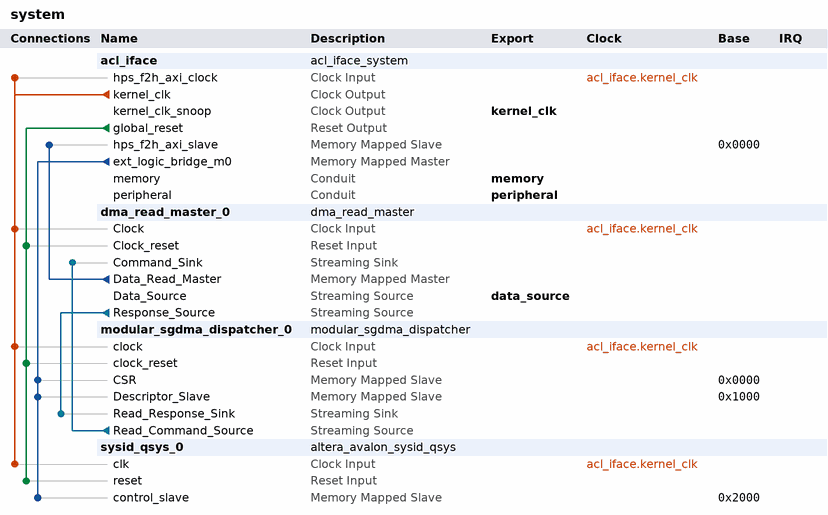
[diagram p0: system contents]
# Platform Designer (Qsys) system system, Cyclone V 5CSXFC6C6U23C7
# Parameters at their usual value, and those the tool derives, are not listed.
package require -exact qsys 16.0
create_system system
set_project_property DEVICE_FAMILY {Cyclone V}
set_project_property DEVICE 5CSXFC6C6U23C7

add_instance acl_iface acl_iface_system 1.0

add_instance dma_read_master_0 dma_read_master 16.0
set_instance_parameter_value dma_read_master_0 BURST_ENABLE 1
set_instance_parameter_value dma_read_master_0 CHANNEL_ENABLE 0
set_instance_parameter_value dma_read_master_0 CHANNEL_WIDTH 8
set_instance_parameter_value dma_read_master_0 DATA_WIDTH 64
set_instance_parameter_value dma_read_master_0 ERROR_ENABLE 0
set_instance_parameter_value dma_read_master_0 ERROR_WIDTH 8
set_instance_parameter_value dma_read_master_0 FIFO_DEPTH 1024
set_instance_parameter_value dma_read_master_0 FIFO_SPEED_OPTIMIZATION 1
set_instance_parameter_value dma_read_master_0 FIX_ADDRESS_WIDTH 32
set_instance_parameter_value dma_read_master_0 GUI_BURST_WRAPPING_SUPPORT 0
set_instance_parameter_value dma_read_master_0 GUI_MAX_BURST_COUNT 128
set_instance_parameter_value dma_read_master_0 GUI_PROGRAMMABLE_BURST_ENABLE 0
set_instance_parameter_value dma_read_master_0 GUI_STRIDE_WIDTH 1
set_instance_parameter_value dma_read_master_0 LENGTH_WIDTH 32
set_instance_parameter_value dma_read_master_0 PACKET_ENABLE 0
set_instance_parameter_value dma_read_master_0 STRIDE_ENABLE 0
set_instance_parameter_value dma_read_master_0 TRANSFER_TYPE {Aligned Accesses}
set_instance_parameter_value dma_read_master_0 USE_FIX_ADDRESS_WIDTH 0

add_instance modular_sgdma_dispatcher_0 modular_sgdma_dispatcher 16.0
set_instance_parameter_value modular_sgdma_dispatcher_0 BURST_ENABLE 0
set_instance_parameter_value modular_sgdma_dispatcher_0 BURST_WRAPPING_SUPPORT 0
set_instance_parameter_value modular_sgdma_dispatcher_0 CSR_ADDRESS_WIDTH 3
set_instance_parameter_value modular_sgdma_dispatcher_0 DATA_FIFO_DEPTH 32
set_instance_parameter_value modular_sgdma_dispatcher_0 DATA_WIDTH 32
set_instance_parameter_value modular_sgdma_dispatcher_0 DESCRIPTOR_FIFO_DEPTH 16
set_instance_parameter_value modular_sgdma_dispatcher_0 ENHANCED_FEATURES 1
set_instance_parameter_value modular_sgdma_dispatcher_0 GUI_RESPONSE_PORT 0
set_instance_parameter_value modular_sgdma_dispatcher_0 MAX_BURST_COUNT 2
set_instance_parameter_value modular_sgdma_dispatcher_0 MAX_BYTE 1024
set_instance_parameter_value modular_sgdma_dispatcher_0 MAX_STRIDE 1
set_instance_parameter_value modular_sgdma_dispatcher_0 MODE 1
set_instance_parameter_value modular_sgdma_dispatcher_0 PREFETCHER_USE_CASE 0
set_instance_parameter_value modular_sgdma_dispatcher_0 PROGRAMMABLE_BURST_ENABLE 0
set_instance_parameter_value modular_sgdma_dispatcher_0 STRIDE_ENABLE 0
set_instance_parameter_value modular_sgdma_dispatcher_0 TRANSFER_TYPE {Aligned Accesses}

add_instance sysid_qsys_0 altera_avalon_sysid_qsys 16.0
set_instance_parameter_value sysid_qsys_0 id -1091581186

# connections
add_connection acl_iface.kernel_clk acl_iface.hps_f2h_axi_clock clock
add_connection acl_iface.kernel_clk dma_read_master_0.Clock clock
add_connection acl_iface.kernel_clk modular_sgdma_dispatcher_0.clock clock
add_connection acl_iface.kernel_clk sysid_qsys_0.clk clock
add_connection acl_iface.global_reset dma_read_master_0.Clock_reset reset
add_connection acl_iface.global_reset modular_sgdma_dispatcher_0.clock_reset reset
add_connection acl_iface.global_reset sysid_qsys_0.reset reset
add_connection acl_iface.ext_logic_bridge_m0 modular_sgdma_dispatcher_0.CSR avalon
set_connection_parameter_value acl_iface.ext_logic_bridge_m0/modular_sgdma_dispatcher_0.CSR baseAddress 0x0000
add_connection acl_iface.ext_logic_bridge_m0 modular_sgdma_dispatcher_0.Descriptor_Slave avalon
set_connection_parameter_value acl_iface.ext_logic_bridge_m0/modular_sgdma_dispatcher_0.Descriptor_Slave baseAddress 0x1000
add_connection acl_iface.ext_logic_bridge_m0 sysid_qsys_0.control_slave avalon
set_connection_parameter_value acl_iface.ext_logic_bridge_m0/sysid_qsys_0.control_slave baseAddress 0x2000
add_connection dma_read_master_0.Data_Read_Master acl_iface.hps_f2h_axi_slave avalon
set_connection_parameter_value dma_read_master_0.Data_Read_Master/acl_iface.hps_f2h_axi_slave baseAddress 0x0000
add_connection dma_read_master_0.Response_Source modular_sgdma_dispatcher_0.Read_Response_Sink avalon_streaming
add_connection modular_sgdma_dispatcher_0.Read_Command_Source dma_read_master_0.Command_Sink avalon_streaming

# exported interfaces
add_interface data_source avalon_streaming source
set_interface_property data_source EXPORT_OF dma_read_master_0.Data_Source
add_interface kernel_clk clock source
set_interface_property kernel_clk EXPORT_OF acl_iface.kernel_clk_snoop
add_interface memory conduit end
set_interface_property memory EXPORT_OF acl_iface.memory
add_interface peripheral conduit end
set_interface_property peripheral EXPORT_OF acl_iface.peripheral

set_interconnect_requirement {$system} qsys_mm.clockCrossingAdapter FIFO
set_interconnect_requirement {$system} qsys_mm.maxAdditionalLatency 0

save_system system.qsys
